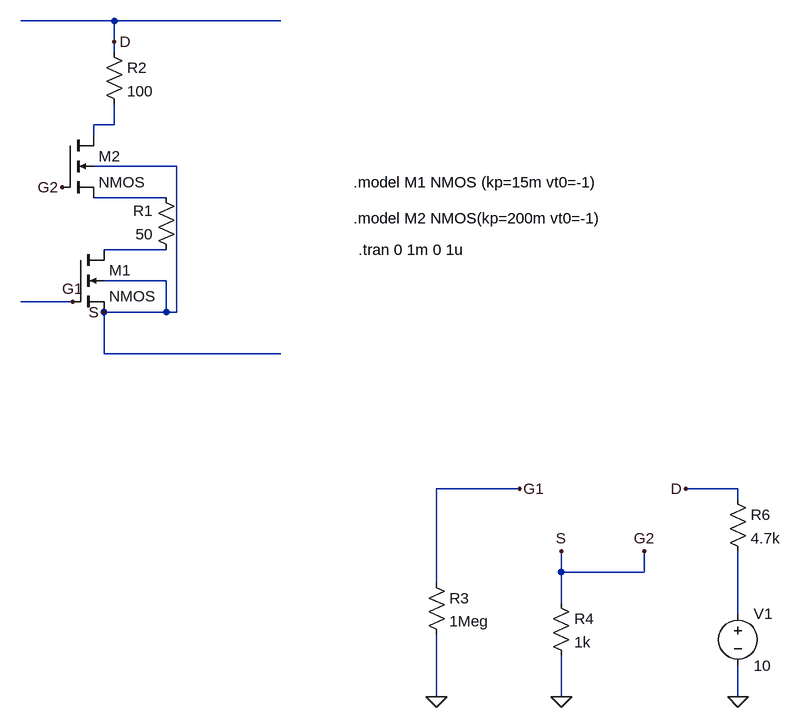
[diagram p0: schematic Draft2.asc]
Draft2.asc, the LTspice schematic file:
Version 4
SHEET 1 1800 884
WIRE 144 -176 0 -176
WIRE 400 -176 144 -176
WIRE 144 -144 144 -176
WIRE 144 -128 144 -144
WIRE 144 -16 144 -48
WIRE 144 -16 112 -16
WIRE 112 0 112 -16
WIRE 240 48 112 48
WIRE 224 96 112 96
WIRE 224 176 128 176
WIRE 224 224 128 224
WIRE 80 256 0 256
WIRE 224 272 224 224
WIRE 224 272 128 272
WIRE 240 272 240 48
WIRE 240 272 224 272
WIRE 128 336 128 272
WIRE 400 336 128 336
WIRE 768 544 640 544
WIRE 1104 544 1024 544
WIRE 1104 560 1104 544
WIRE 832 672 832 640
WIRE 960 672 960 640
WIRE 960 672 832 672
WIRE 640 688 640 544
WIRE 832 720 832 672
WIRE 1104 736 1104 640
WIRE 640 864 640 768
WIRE 832 864 832 800
WIRE 1104 864 1104 816
FLAG 128 272 S
FLAG 80 256 G1
FLAG 64 80 G2
FLAG 144 -144 D
FLAG 768 544 G1
FLAG 960 640 G2
FLAG 1024 544 D
FLAG 832 640 S
FLAG 640 864 0
FLAG 832 864 0
FLAG 1104 864 0
SYMBOL nmos4 80 176 R0
SYMATTR InstName M1
SYMATTR Value2 l=1 w=1
SYMBOL nmos4 64 0 R0
SYMATTR InstName M2
SYMATTR Value2 l=1 w=1
SYMBOL res 240 192 R180
WINDOW 0 36 76 Left 2
WINDOW 3 36 40 Left 2
SYMATTR InstName R1
SYMATTR Value 50
SYMBOL res 128 -144 R0
SYMATTR InstName R2
SYMATTR Value 100
SYMBOL res 624 672 R0
SYMATTR InstName R3
SYMATTR Value 1Meg
SYMBOL res 816 704 R0
SYMATTR InstName R4
SYMATTR Value 1k
SYMBOL res 1088 544 R0
SYMATTR InstName R6
SYMATTR Value 4.7k
SYMBOL voltage 1104 720 R0
WINDOW 123 0 0 Left 0
WINDOW 39 0 0 Left 0
SYMATTR InstName V1
SYMATTR Value 10
TEXT 512 72 Left 2 !.model M1 NMOS (kp=15m vt0=-1)
TEXT 512 128 Left 2 !.model M2 NMOS(kp=200m vt0=-1)
TEXT 520 176 Left 2 !.tran 0 1m 0 1u

The netlist it stands for:
* Draft2.asc
M1 N003 G1 G2 G2 NMOS l=1 w=1
M2 N001 G2 N002 G2 NMOS l=1 w=1
R1 N003 N002 50
R2 D N001 100
R3 G1 0 1Meg
R4 G2 0 1k
R6 D N004 4.7k
V1 N004 0 10
.model NMOS NMOS
.model PMOS PMOS
.lib standard.mos
.model M1 NMOS (kp=15m vt0=-1)
.model M2 NMOS(kp=200m vt0=-1)
.tran 0 1m 0 1u
.backanno
.end